# EAGLE schematic power electronicsV4.3 (EAGLE 9.6.2)

## Sheet 1 of 3
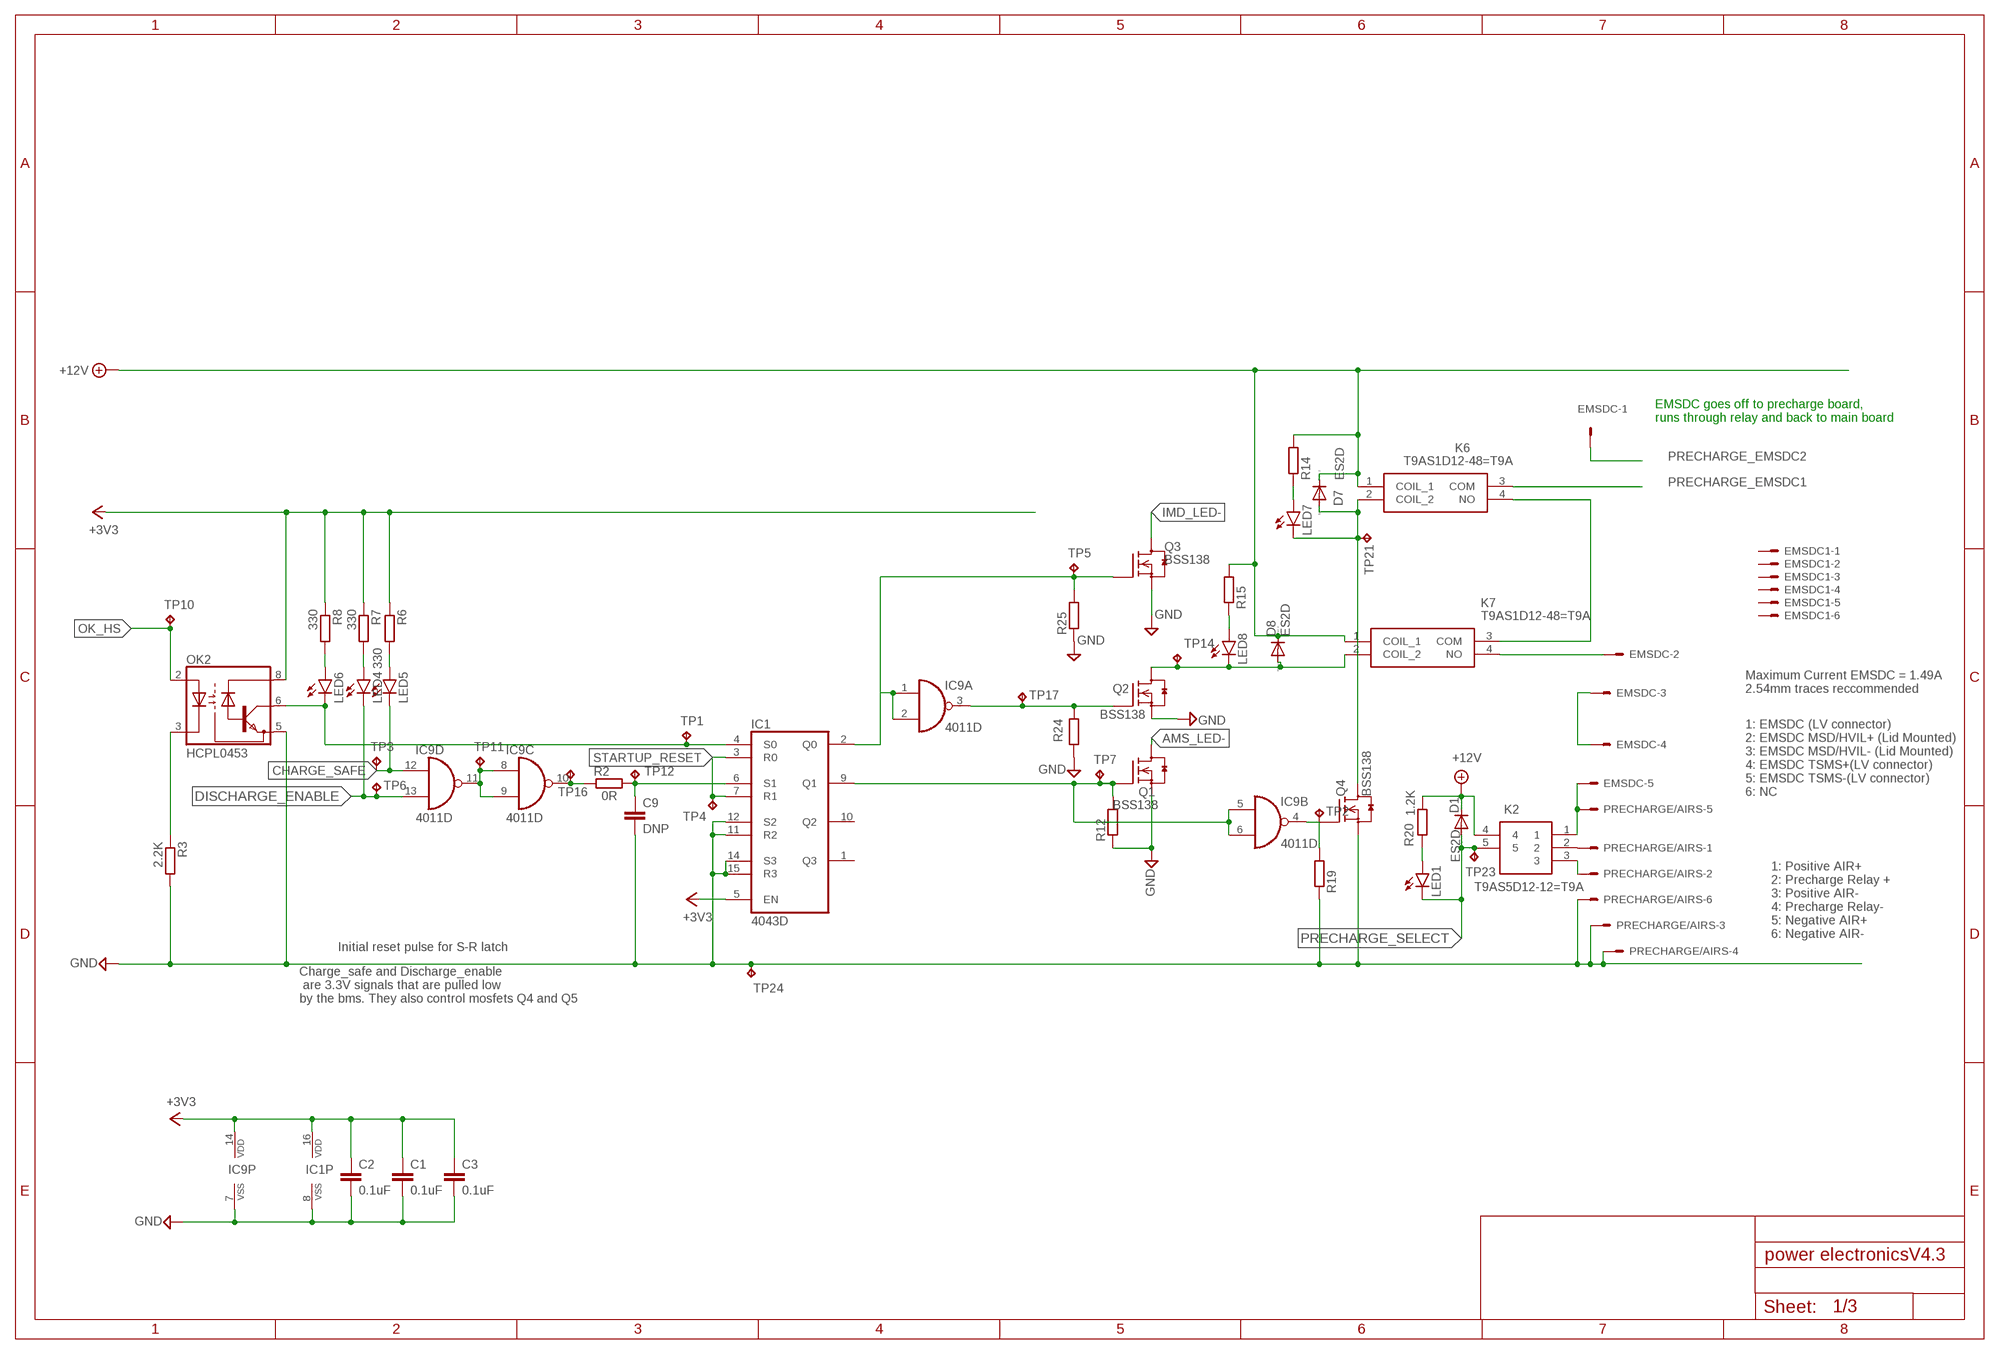
[diagram p0: schematic, sheet 1]

### Parts
C1  0.1uF  C-EUC0805  [C0805]
C2  0.1uF  C-EUC0805  [C0805]
C3  0.1uF  C-EUC0805  [C0805]
C9  DNP  C-EUC0805K  [C0805K]
D1  ES2D  [SMB]
D7  ES2D  [SMB]
D8  ES2D  [SMB]
EMSDC  KK-156-6  [KK-156-6]
EMSDC1  KK-156-6  [KK-156-6]
IC1  4043D  [SO16]
IC9  4011D  [SO14]
K2  T9AS5D12-12=T9A  [T9AS1D12]
K6  T9AS1D12-48=T9A  [T9AS1D1248T9A]
K7  T9AS1D12-48=T9A  [T9AS1D1248T9A]
LED1  LEDSML0805  [SML0805]
LED4  LEDSML0805  [SML0805]
LED5  LEDSML0805  [SML0805]
LED6  LEDSML0805  [SML0805]
LED7  LEDSML0805  [SML0805]
LED8  LEDSML0805  [SML0805]
OK2  HCPL0453  [SOIC08]
PRECHARGE/AIRS  KK-156-6  [KK-156-6]
Q1  BSS138  [SOT23]
Q2  BSS138  [SOT23]
Q3  BSS138  [SOT23]
Q4  BSS138  [SOT23]
R2  0R  R-EU_R0805  [R0805]
R3  2.2K  R-EU_R0805  [R0805]
R6  330  R-EU_R0805  [R0805]
R7  330  R-EU_R0805  [R0805]
R8  330  R-EU_R0805  [R0805]
R12  R-EU_R0805  [R0805]
R14  R-EU_R0805  [R0805]
R15  R-EU_R0805  [R0805]
R19  R-EU_R0805  [R0805]
R20  1.2K  R-EU_R0805  [R0805]
R24  R-EU_R0805  [R0805]
R25  R-EU_R0805  [R0805]
TP1  TPPAD1-17  [P1-17]
TP2  TPPAD1-17  [P1-17]
TP3  TPPAD1-17  [P1-17]
TP4  TPPAD1-17  [P1-17]
TP5  TPPAD1-17  [P1-17]
TP6  TPPAD1-17  [P1-17]
TP7  TPPAD1-17  [P1-17]
TP10  TPPAD1-17  [P1-17]
TP11  TPPAD1-17  [P1-17]
TP12  TPPAD1-17  [P1-17]
TP14  TPPAD1-17  [P1-17]
TP16  TPPAD1-17  [P1-17]
TP17  TPPAD1-17  [P1-17]
TP21  TPPAD1-17  [P1-17]
TP23  TPPAD1-17  [P1-17]
TP24  TPPAD1-17  [P1-17]

### Nets
+3V3: C1.1 C2.1 C3.1 IC1.5(EN) IC1.16(VDD) IC9.14(P:VDD) OK2.8(VCC) R6.1 R7.1 R8.1 ; also sheet 2,3
+12V [power]: D1.C D7.C D8.C K2.4 K6.1(COIL_1) K7.1(COIL_1) R14.2 R15.2 R20.1 ; also sheet 2,3
AMS_LED-: Q1.3(D)
CHARGE_SAFE: IC9.12(D:I0) LED5.C TP3.TP ; also sheet 3
DISCHARGE_ENABLE: IC1.9(Q1) IC9.5(B:I0) IC9.6(B:I1) IC9.13(D:I1) LED4.C Q1.1(G) R12.2 TP6.TP TP7.TP ; also sheet 3
GND [GND]: C1.2 C2.2 C3.2 C9.2 IC1.8(VSS) IC1.11(R2) IC1.12(S2) IC1.14(S3) IC1.15(R3) IC9.7(P:VSS) OK2.5(GND) PRECHARGE/AIRS.3 PRECHARGE/AIRS.4 PRECHARGE/AIRS.6 Q1.2(S) Q2.2(S) Q3.2(S) Q4.2(S) R3.2 R12.1 R19.1 R24.1 R25.1 TP24.TP ; also sheet 2,3
IMD_COIL_OUT: D8.A K7.2(COIL_2) LED8.C Q2.3(D) TP14.TP
IMD_LED-: Q3.3(D)
N$1: IC9.10(C:O) R2.1 TP16.TP
N$3 [EMSDC]: K2.2 PRECHARGE/AIRS.1
N$5: IC1.4(S0) LED6.C OK2.6(VO) TP1.TP
N$6: IC9.8(C:I0) IC9.9(C:I1) IC9.11(D:O) TP11.TP
N$7: OK2.3(C) R3.1
N$8: IC9.3(A:O) Q2.1(G) R24.2 TP17.TP
N$9: IC1.2(Q0) IC9.1(A:I0) IC9.2(A:I1) Q3.1(G) R25.2 TP5.TP
N$10: C9.1 IC1.6(S1) R2.2 TP12.TP
N$11 [EMSDC]: EMSDC.5 K2.1 PRECHARGE/AIRS.5
N$12 [EMSDC]: K2.3 PRECHARGE/AIRS.2
N$14: EMSDC.2 K7.4(NO)
N$15 [GND]: D7.A K6.2(COIL_2) LED7.C Q4.3(D) TP21.TP
N$16: IC9.4(B:O) Q4.1(G) R19.2 TP2.TP
N$18: LED7.A R14.1
N$19 [EMSDC]: EMSDC.3 EMSDC.4
N$20: LED8.A R15.1
N$21 [GND]: K6.4(NO) K7.3(COM)
N$22: LED1.A R20.2
N$25: LED4.A R7.2
N$26: LED5.A R6.2
N$27: LED6.A R8.2
OK_HS: OK2.2(A) TP10.TP ; also sheet 3
PRECHARGE_EMSDC1: K6.3(COM) ; also sheet 3
PRECHARGE_EMSDC2: EMSDC.1 ; also sheet 3
PRECHARGE_SELECT: D1.A K2.5 LED1.C TP23.TP ; also sheet 3
STARTUP_RESET: IC1.3(R0) IC1.7(R1) TP4.TP ; also sheet 2
Unconnected: EMSDC1.1 EMSDC1.2 EMSDC1.3 EMSDC1.4 EMSDC1.5 EMSDC1.6 EMSDC.6 IC1.1(Q3) IC1.10(Q2)

### Notes on the sheet
- EMSDC goes off to precharge board, 
  runs through relay and back to main board
- Maximum Current EMSDC = 1.49A
  2.54mm traces reccommended
- 1: EMSDC (LV connector)
  2: EMSDC MSD/HVIL+ (Lid Mounted)
  3: EMSDC MSD/HVIL- (Lid Mounted)
  4: EMSDC TSMS+(LV connector)
  5: EMSDC TSMS-(LV connector)
  6: NC
- 1: Positive AIR+
  2: Precharge Relay +
  3: Positive AIR-
  4: Precharge Relay-
  5: Negative AIR+
  6: Negative AIR-
- Initial reset pulse for S-R latch
- Charge_safe and Discharge_enable
   are 3.3V signals that are pulled low 
  by the bms. They also control mosfets Q4 and Q5

## Sheet 2 of 3
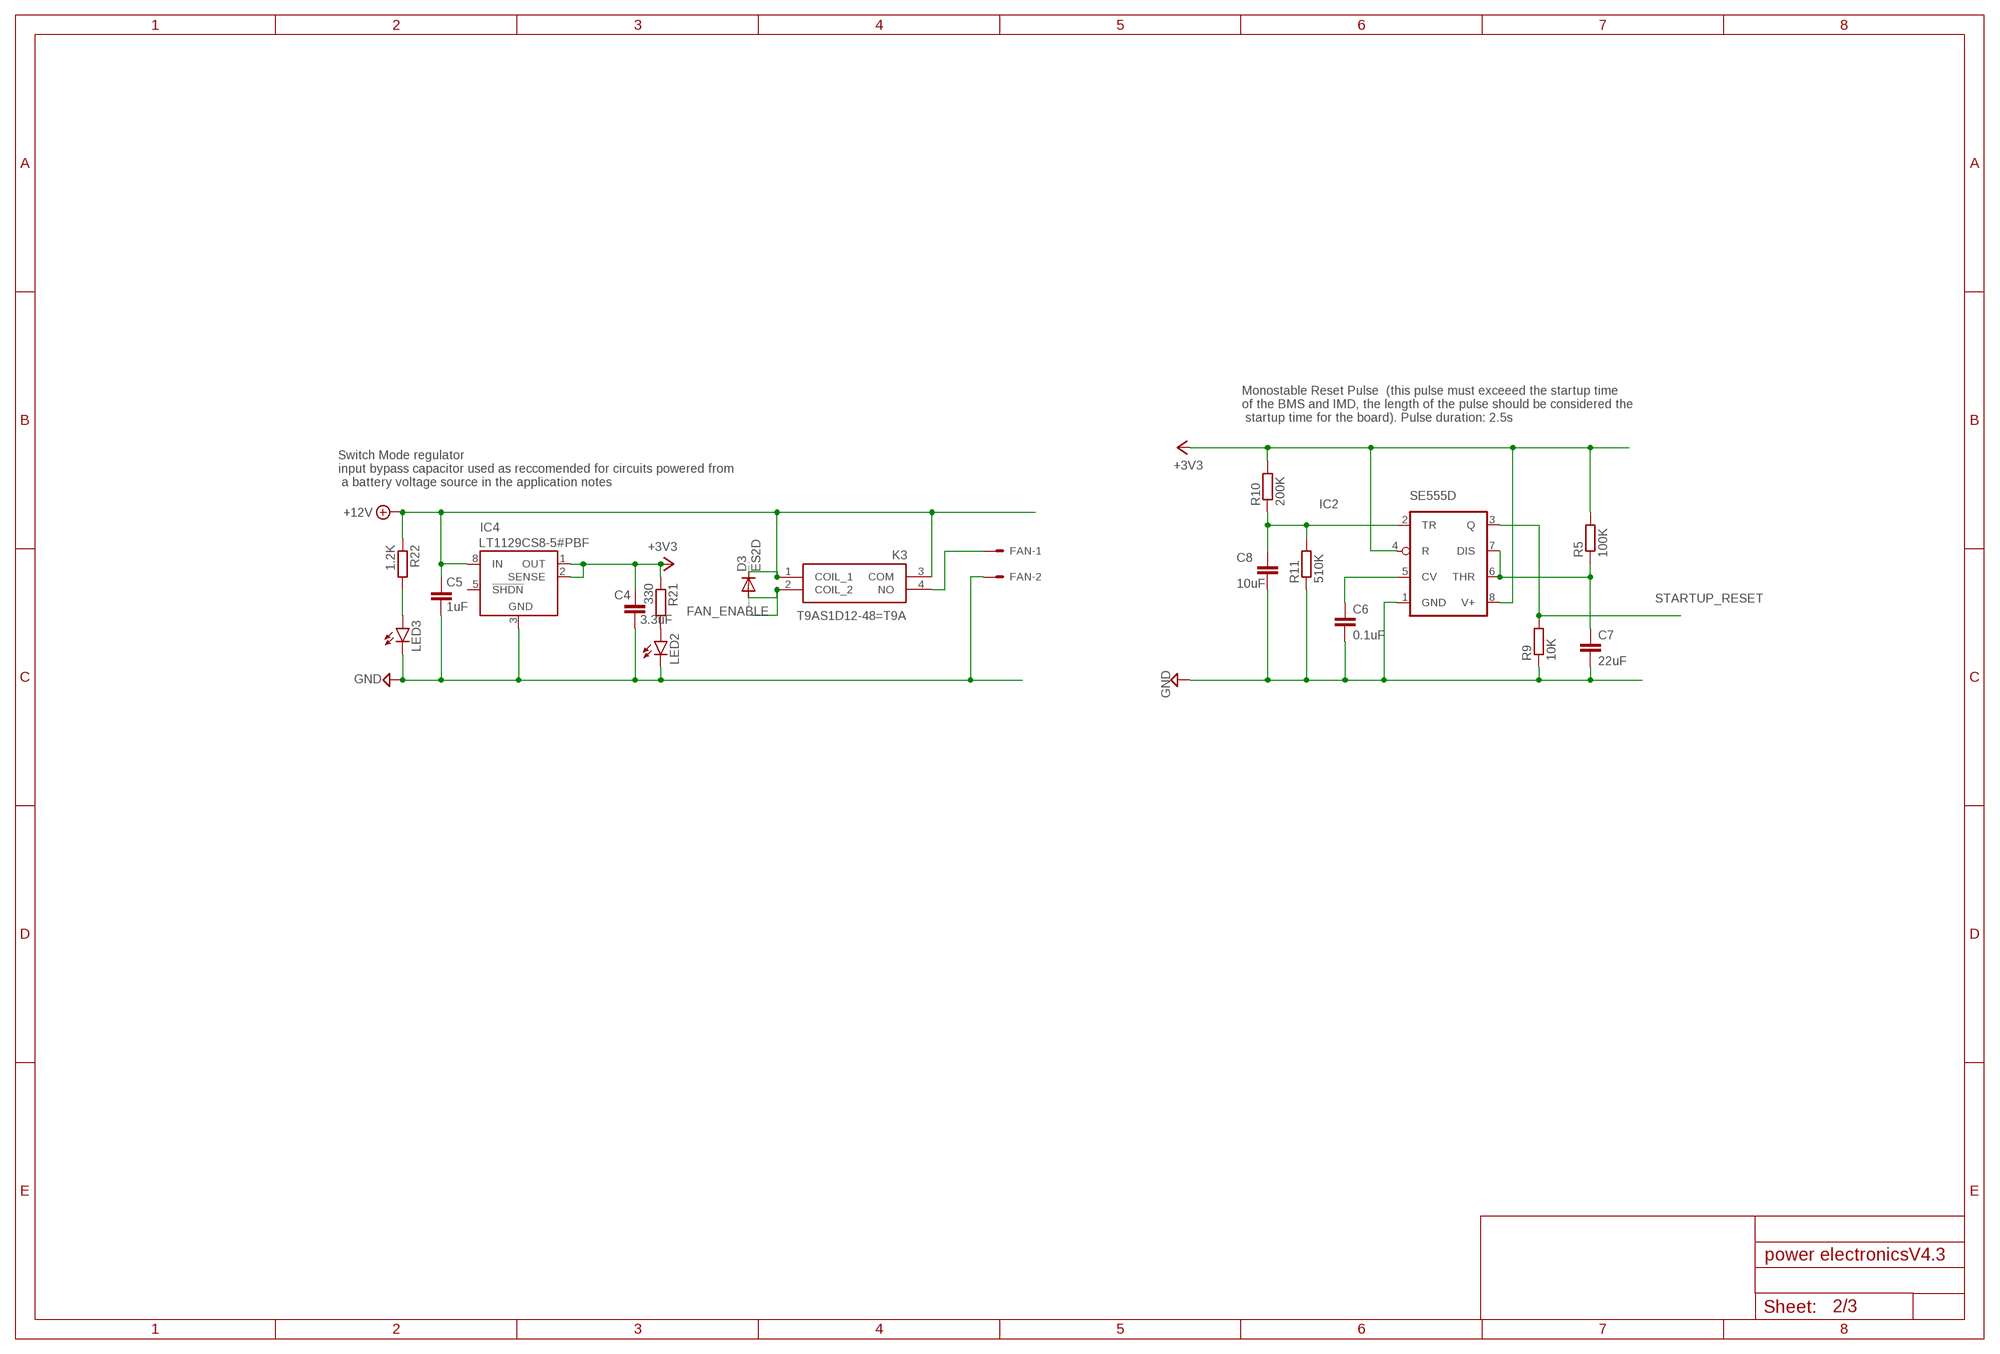
[diagram p1: schematic, sheet 2]

### Parts
C4  3.3uF  C-EUC0805  [C0805]
C5  1uF  C-EUC0805  [C0805]
C6  0.1uF  C-EUC0805  [C0805]
C7  22uF  C-EUC1206  [C1206]
C8  10uF  C-EUC0805  [C0805]
D3  ES2D  [SMB]
FAN  KK-156-2  [KK-156-2]
IC2  SE555D  [SO08]
IC4  LT1129CS8  [SOIC8]
K3  T9AS1D12-48=T9A  [T9AS1D1248T9A]
LED2  LEDSML0805  [SML0805]
LED3  LEDSML0805  [SML0805]
R5  100K  R-EU_R0805  [R0805]
R9  10K  R-EU_R0805  [R0805]
R10  200K  R-EU_R0805  [R0805]
R11  510K  R-EU_R0805  [R0805]
R21  330  R-EU_R0805  [R0805]
R22  1.2K  R-EU_R0805  [R0805]

### Nets
+3V3: C4.1 IC2.4(R) IC2.8(V+) IC4.1(OUT) IC4.2(SENSE) R5.2 R10.2 R21.1 ; also sheet 1,3
+12V [power]: C5.1 D3.C IC4.8(IN) K3.1(COIL_1) K3.3(COM) R22.1 ; also sheet 1,3
FAN+ [power]: FAN.1 K3.4(NO)
FAN_ENABLE: D3.A K3.2(COIL_2) ; also sheet 3
GND [GND]: C4.2 C5.2 C6.2 C7.2 C8.2 FAN.2 IC2.1(GND) IC4.3(GND) LED2.C LED3.C R9.1 R11.1 ; also sheet 1,3
N$17: C7.1 IC2.6(THR) IC2.7(DIS) R5.1
N$23: LED2.A R21.2
N$24: LED3.A R22.2
N$28: C8.1 IC2.2(TR) R10.1 R11.2
N$32: C6.1 IC2.5(CV)
STARTUP_RESET: IC2.3(Q) R9.2 ; also sheet 1
Unconnected: IC4.4(NC) IC4.5(!SHDN)

### Notes on the sheet
- Monostable Reset Pulse  (this pulse must exceeed the startup time 
  of the BMS and IMD, the length of the pulse should be considered the
   startup time for the board). Pulse duration: 2.5s
- Switch Mode regulator
  input bypass capacitor used as reccomended for circuits powered from
   a battery voltage source in the application notes

## Sheet 3 of 3
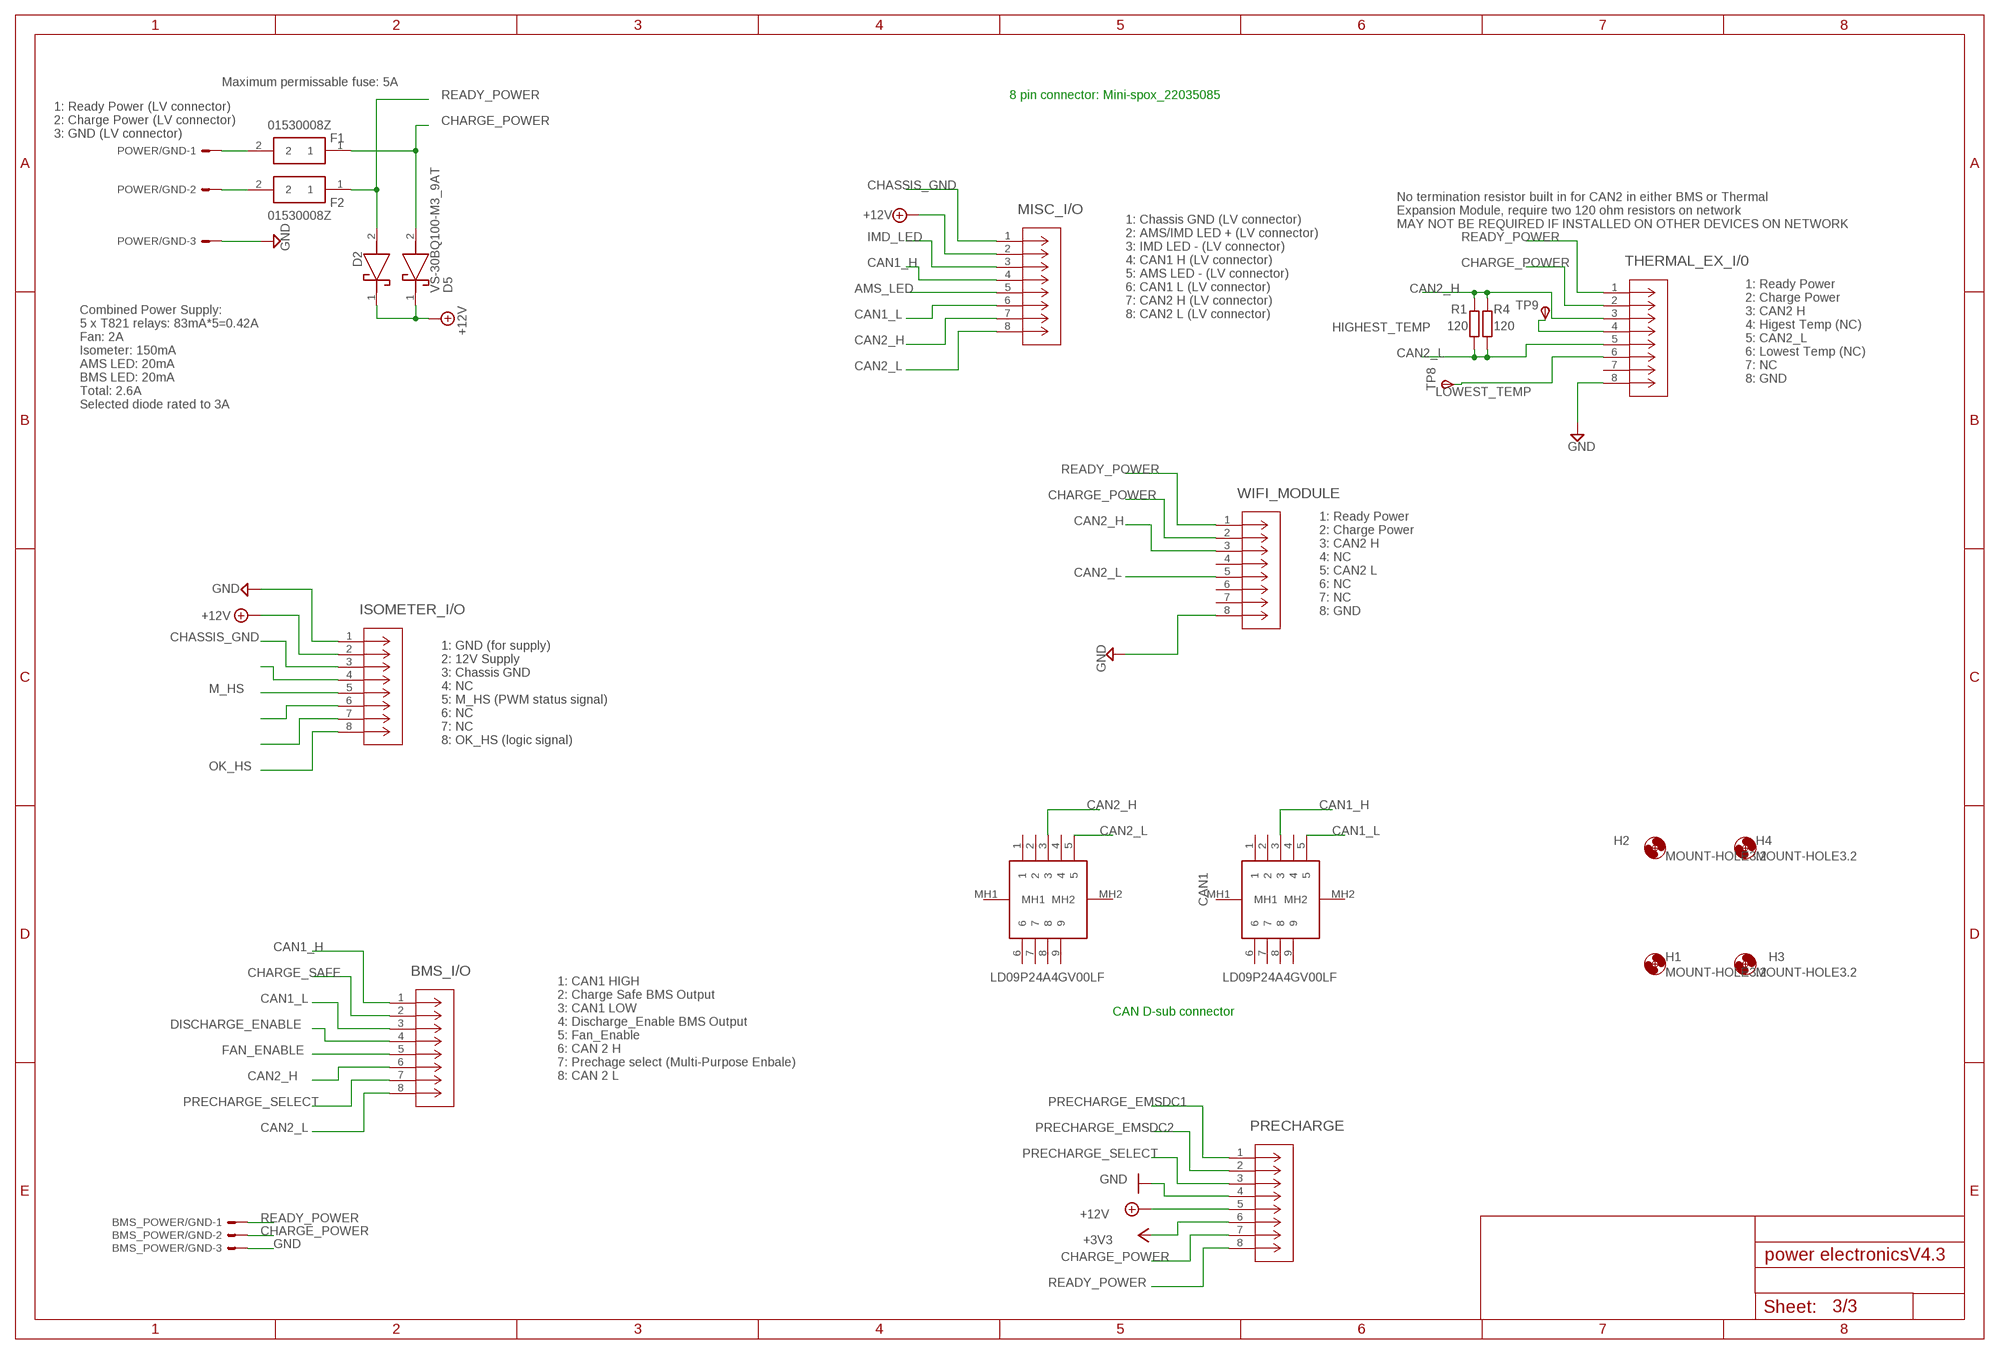
[diagram p2: schematic, sheet 3]

### Parts
BMS_I/O  MINI-SPOX_22035085  [CON_22035085_MOL]
BMS_POWER/GND  KK-156-3  [KK-156-3]
CAN1  LD09P24A4GV00LF  [LD09P24A4GV00LF]
CAN2  LD09P24A4GV00LF  [LD09P24A4GV00LF]
D2  VS-30BQ100-M3_9AT  [DIOM7959X262N]
D5  VS-30BQ100-M3_9AT  [DIOM7959X262N]
F1  01530008Z  [01530008]
F2  01530008Z  [01530008]
H1  MOUNT-HOLE3.2  [3,2]
H2  MOUNT-HOLE3.2  [3,2]
H3  MOUNT-HOLE3.2  [3,2]
H4  MOUNT-HOLE3.2  [3,2]
ISOMETER_I/O  MINI-SPOX_22035085  [CON_22035085_MOL]
MISC_I/O  MINI-SPOX_22035085  [CON_22035085_MOL]
POWER/GND  KK-156-3  [KK-156-3]
PRECHARGE  MINI-SPOX_22035085  [CON_22035085_MOL]
R1  120  R-EU_R1206  [R1206]
R4  120  R-EU_R1206  [R1206]
THERMAL_EX_I/0  MINI-SPOX_22035085  [CON_22035085_MOL]
TP8  TPSTP11R  [TP11R]
TP9  TPSTP11R  [TP11R]
WIFI_MODULE  MINI-SPOX_22035085  [CON_22035085_MOL]

### Nets
+3V3: PRECHARGE.6 ; also sheet 1,2
+12V [power]: D2.1(K) D5.1(K) ISOMETER_I/O.2 MISC_I/O.2 PRECHARGE.5 ; also sheet 1,2
AMS_LED: MISC_I/O.5
CAN1_H: BMS_I/O.1 CAN1.3 MISC_I/O.4
CAN1_L: BMS_I/O.3 CAN1.5 MISC_I/O.6
CAN2_H: BMS_I/O.6 CAN2.3 MISC_I/O.7 R1.1 R4.1 THERMAL_EX_I/0.3 WIFI_MODULE.3
CAN2_L: BMS_I/O.8 CAN2.5 MISC_I/O.8 R1.2 R4.2 THERMAL_EX_I/0.5 WIFI_MODULE.5
CHARGE_POWER [power]: BMS_POWER/GND.2 D5.2(A) F1.1 PRECHARGE.7 THERMAL_EX_I/0.2 WIFI_MODULE.2
CHARGE_SAFE: BMS_I/O.2 ; also sheet 1
CHASSIS_GND [GND]: ISOMETER_I/O.3 MISC_I/O.1
DISCHARGE_ENABLE: BMS_I/O.4 ; also sheet 1
FAN_ENABLE: BMS_I/O.5 ; also sheet 2
GND [GND]: BMS_POWER/GND.3 ISOMETER_I/O.1 POWER/GND.3 PRECHARGE.4 THERMAL_EX_I/0.8 WIFI_MODULE.8 ; also sheet 1,2
HIGHEST_TEMP: THERMAL_EX_I/0.4 TP9.TP(PP)
IMD_LED: MISC_I/O.3
LOWEST_TEMP: THERMAL_EX_I/0.6 TP8.TP(PP)
M_HS: ISOMETER_I/O.5
N$2 [power]: F2.2 POWER/GND.2
N$4 [power]: F1.2 POWER/GND.1
N$46: ISOMETER_I/O.4
N$51: ISOMETER_I/O.7
N$52: ISOMETER_I/O.6
OK_HS: ISOMETER_I/O.8 ; also sheet 1
PRECHARGE_EMSDC1: PRECHARGE.1 ; also sheet 1
PRECHARGE_EMSDC2: PRECHARGE.2 ; also sheet 1
PRECHARGE_SELECT: BMS_I/O.7 PRECHARGE.3 ; also sheet 1
READY_POWER [power]: BMS_POWER/GND.1 D2.2(A) F2.1 PRECHARGE.8 THERMAL_EX_I/0.1 WIFI_MODULE.1
Unconnected: CAN1.1 CAN1.2 CAN1.4 CAN1.6 CAN1.7 CAN1.8 CAN1.9 CAN1.MH1 CAN1.MH2 CAN2.1 CAN2.2 CAN2.4 CAN2.6 CAN2.7 CAN2.8 CAN2.9 CAN2.MH1 CAN2.MH2 THERMAL_EX_I/0.7 WIFI_MODULE.4 WIFI_MODULE.6 WIFI_MODULE.7

### Notes on the sheet
- Maximum permissable fuse: 5A
- 8 pin connector: Mini-spox_22035085
- 1: Ready Power (LV connector)
  2: Charge Power (LV connector)
  3: GND (LV connector)
- No termination resistor built in for CAN2 in either BMS or Thermal
  Expansion Module, require two 120 ohm resistors on network
  MAY NOT BE REQUIRED IF INSTALLED ON OTHER DEVICES ON NETWORK
- 1: Chassis GND (LV connector)
  2: AMS/IMD LED + (LV connector)
  3: IMD LED - (LV connector)
  4: CAN1 H (LV connector)
  5: AMS LED - (LV connector)
  6: CAN1 L (LV connector)
  7: CAN2 H (LV connector)
  8: CAN2 L (LV connector)
- 1: Ready Power
  2: Charge Power
  3: CAN2 H
  4: Higest Temp (NC)
  5: CAN2_L
  6: Lowest Temp (NC)
  7: NC
  8: GND
- Combined Power Supply:
  5 x T821 relays: 83mA*5=0.42A
  Fan: 2A
  Isometer: 150mA
  AMS LED: 20mA
  BMS LED: 20mA
  Total: 2.6A
  Selected diode rated to 3A
- 1: Ready Power
  2: Charge Power
  3: CAN2 H
  4: NC
  5: CAN2 L
  6: NC
  7: NC
  8: GND
- 1: GND (for supply) 
  2: 12V Supply
  3: Chassis GND 
  4: NC 
  5: M_HS (PWM status signal)
  6: NC
  7: NC
  8: OK_HS (logic signal)
- CAN D-sub connector
- 1: CAN1 HIGH
  2: Charge Safe BMS Output 
  3: CAN1 LOW
  4: Discharge_Enable BMS Output
  5: Fan_Enable
  6: CAN 2 H
  7: Prechage select (Multi-Purpose Enbale)
  8: CAN 2 L

## Power pins joined to a net without a drawn wire
GND: IC4.6(GND) IC4.7(GND)

## Library data of the parts
BMS_I/O ISOMETER_I/O MISC_I/O PRECHARGE THERMAL_EX_I/0 WIFI_MODULE = Mini-spox_22035085:MINI-SPOX_22035085; COPYRIGHT: Copyright (C) 2023 Ultra Librarian. All rights reserved.; MANUFACTURER_PART_NUMBER: 22035085; MFR_NAME: Molex Connector Corporation
BMS_POWER/GND POWER/GND = con-molex:KK-156-3: KK 156 HEADER Source: http://www.molex.com/pdm_docs/sd/026604100_sd.pdf; MF: MOLEX; OC_FARNELL: unknown; OC_NEWARK: unknown
C1-C9 = rcl:C-EU: CAPACITOR, European symbol; SPICEPREFIX: C
CAN1 CAN2 = LD09P24A4GV00LF:LD09P24A4GV00LF: Amphenol FCI LD Series, 9 Way Plug-In Mount D-sub Connector Plug, 2.74mm Pitch, with Screw Source: Datasheet <https://www.mouser.com/datasheet/2/18/10130912-1362365.pdf>; ARROW_PART_NUMBER: LD09P24A4GV00LF; ARROW_PRICE-STOCK: https://www.arrow.com/en/products/ld09p24a4gv00lf/amphenol-fci?region=nac; DESCRIPTION: Amphenol FCI LD Series, 9 Way Plug-In Mount D-sub Connector Plug, 2.74mm Pitch, with Screw; HEIGHT: 12.15mm; MANUFACTURER_NAME: Amphenol Communication Solutions; MANUFACTURER_PART_NUMBER: LD09P24A4GV00LF; MOUSER_PART_NUMBER: 649-LD09P24A4GV00LF; MOUSER_PRICE-STOCK: https://www.mouser.co.uk/ProductDetail/Amphenol-FCI/LD09P24A4GV00LF?qs=tZOhSuJQg1nfkziarphghA%3D%3D
D1 D3 D7 D8 = diode:ES2D: DIODE super fast rectifier, 2 A
D2 D5 = SamacSys_Parts:VS-30BQ100-M3_9AT: Vishay VS-30BQ100-M3/9AT SMT Schottky Diode, 100V 3A, 2-Pin DO-214AB Source: Datasheet <https://componentsearchengine.com/Datasheets/1/VS-30BQ100-M3_9AT.pdf>; DESCRIPTION: Vishay VS-30BQ100-M3/9AT SMT Schottky Diode, 100V 3A, 2-Pin DO-214AB; HEIGHT: 2.62mm; MANUFACTURER_NAME: Vishay; MANUFACTURER_PART_NUMBER: VS-30BQ100-M3/9AT; MOUSER_PART_NUMBER: 78-VS-30BQ100-M39AT; MOUSER_PRICE-STOCK: https://www.mouser.com/Search/Refine.aspx?Keyword=78-VS-30BQ100-M39AT
EMSDC EMSDC1 PRECHARGE/AIRS = con-molex:KK-156-6: KK 156 HEADER Source: http://www.molex.com/pdm_docs/sd/026604100_sd.pdf; MF: MOLEX; OC_FARNELL: unknown; OC_NEWARK: unknown
F1 F2 = SamacSys_Parts:01530008Z: Mini fuseholder,15A 32V Littelfuse 15A PCB Mount Fuse Holder Automotive Fuse, 32 V Source: Datasheet <http://www.littelfuse.com/data/en/data_sheets/153_pcmount.pdf>; ALLIED_NUMBER: 70184304; DESCRIPTION: Mini fuseholder,15A 32V Littelfuse 15A PCB Mount Fuse Holder Automotive Fuse, 32 V; HEIGHT: mm; MANUFACTURER_NAME: LITTELFUSE; MANUFACTURER_PART_NUMBER: 01530008Z; RS_PART_NUMBER: 3607317; RS_PRICE-STOCK: https://uk.rs-online.com/web/p/products/3607317
FAN = con-molex:KK-156-2: KK 156 HEADER Source: http://www.molex.com/pdm_docs/sd/026604100_sd.pdf; MF: MOLEX; OC_FARNELL: unknown; OC_NEWARK: unknown
H1-H4 = holes:MOUNT-HOLE: MOUNTING HOLE with drill center marker
IC1 = 40xx:4043: Quad 3-state NOR R/S LATCH
IC2 = linear:*555: TIMER
IC4 = linear-technology:LT1129CS8: VOLTAGE REGULATOR with shutdown; MPN: LT1129CS8-5#PBF; OC_FARNELL: 1273576; OC_NEWARK: 57M2078
IC9 = 40xx:4011: Quad 2-input NAND
K2 = SamacSys_Parts:T9AS5D12-12=T9A: PCB Relay SPDT 30A 12Vdc,thru hole SPDT PCB Mount Non-Latching Relay Through Hole, 12V dc Source: Datasheet; ALLIED_NUMBER: R1111589; DESCRIPTION: PCB Relay SPDT 30A 12Vdc,thru hole SPDT PCB Mount Non-Latching Relay Through Hole, 12V dc; HEIGHT: mm; MANUFACTURER_NAME: TE Connectivity; MANUFACTURER_PART_NUMBER: T9AS5D12-12=T9A; RS_PART_NUMBER: 6802528; RS_PRICE-STOCK: https://uk.rs-online.com/web/p/products/6802528
K3 = SamacSys_Parts:T9AS1D12-48=T9A: SPST-NO PCB Mount Non-Latching Relay Through Hole, 48V dc Source: Datasheet; DESCRIPTION: SPST-NO PCB Mount Non-Latching Relay Through Hole, 48V dc; HEIGHT: 20.4mm; MANUFACTURER_NAME: TE Connectivity; MANUFACTURER_PART_NUMBER: T9AS1D12-48=T9A; RS_PART_NUMBER: 6802534P; RS_PRICE-STOCK: http://uk.rs-online.com/web/p/products/6802534P
K6 K7 = T9AS1D12-12=T9A:T9AS1D12-48=T9A: SPST-NO PCB Mount Non-Latching Relay Through Hole, 48V dc Source: Datasheet; DESCRIPTION: SPST-NO PCB Mount Non-Latching Relay Through Hole, 48V dc; HEIGHT: 20.4mm; MANUFACTURER_NAME: TE Connectivity; MANUFACTURER_PART_NUMBER: T9AS1D12-48=T9A
LED1-LED8 = led:LED: LED OSRAM: - CHIPLED LG R971, LG N971, LY N971, LG Q971, LY Q971, LO R971, LY R971 LH N974, LH R974 LS Q976, LO Q976, LY Q976 LO Q996 - Hyper CHIPLED LW Q18S LB Q993, LB Q99A, LB R99A - SideLED LS A670, LO A670, LY A670, LG A670, LP A670 LB A673, LV A673, LT A673, LW A673 LH A674 LY A675 LS A676, LA A676, LO A676, LY A676, LW A676 LS A679, LY A679, LG A679 - Hyper Micro SIDELED® LS Y876, LA Y876, LO Y876, LY Y876 LT Y87S - SmartLED LW L88C, LW L88S LB L89C, LB L89S, LG L890 LS L89K, LO L89K, LY L89K LS L896, LA L896, LO L896, LY L896 - TOPLED LS T670, LO T670, LY T670, LG T670, LP T670 LSG T670, LSP T670, LSY T670, LOP T670, LYG T670 LG T671, LOG T671, LSG T671 LB T673, LV T673, LT T673, LW T673 LH T674 LS T676, LA T676, LO T676, LY T676, LB T676, LH T676, LSB T676, LW T676 LB T67C, LV T67C, LT T67C, LS T67K, LO T67K, LY T67K, LW E67C LS E67B, LA E67B, LO E67B, LY E67B, LB E67C, LV E67C, LT E67C LW T67C LS T679, LY T679, LG T679 LS T770, LO T770, LY T770, LG T770, LP T770 LB T773, LV T773, LT T773, LW T773 LH T774 LS E675, LA E675, LY E675, LS T675 LS T776, LA T776, LO T776, LY T776, LB T776 LHGB T686 LT T68C, LB T68C - Hyper Mini TOPLED® LB M676 - Mini TOPLED Santana® LG M470 LS M47K, LO M47K, LY M47K Source: http://www.osram.convergy.de LUXEON: - LUMILED® LXK2-PW12-R00, LXK2-PW12-S00, LXK2-PW14-U00, LXK2-PW14-V00 LXK2-PM12-R00, LXK2-PM12-S00, LXK2-PM14-U00 LXK2-PE12-Q00, LXK2-PE12-R00, LXK2-PE12-S00, LXK2-PE14-T00, LXK2-PE14-U00 LXK2-PB12-K00, LXK2-PB12-L00, LXK2-PB12-M00, LXK2-PB14-N00, LXK2-PB14-P00, LXK2-PB14-Q00 LXK2-PR12-L00, LXK2-PR12-M00, LXK2-PR14-Q00, LXK2-PR14-R00 LXK2-PD12-Q00, LXK2-PD12-R00, LXK2-PD12-S00 LXK2-PH12-R00, LXK2-PH12-S00 LXK2-PL12-P00, LXK2-PL12-Q00, LXK2-PL12-R00 Source: www.luxeon.com KINGBRIGHT: KA-3528ASYC Source: www.kingbright.com
OK2 = optocoupler:HCPL0453: HEWLETT PACKARD OPTO COUPLER; MF: AGILENT TECHNOLOGIES; MPN: HCPL-0453-000E; OC_FARNELL: 1505123; OC_NEWARK: 88H7766
Q1-Q4 = m-pad-2.1:BSS138: Fairchild Semiconductors BSS138 N-Channel Logic Level Enhancement Mode Field Effect Transistor General Description: These N-Channel enhancement mode field effect transistors are produced using Fairchild's proprietary, high cell density, DMOS technology. These products have been designed to minimize on-state resistance while provide rugged, reliable, and fast switching performance.These products are particularly suited for low voltage, low current applications such as small servo motor control, power MOSFET gate drivers, and other switching applications. Features: 0.22 A, 50 V. RDS(ON) = 3.5Ohm @ VGS = 10 V RDS(ON) = 6.0Ohm @ VGS = 4.5 V High density cell design for extremely low RDS(ON) Rugged and Reliable Compact industry standard SOT-23 surface mount package Please send any comments to: messi@users.sourceforge.net
R1-R12 R14 R15 R19-R22 R24 R25 = rcl:R-EU_: RESISTOR, European symbol; SPICEPREFIX: R
TP1-TP7 TP10-TP12 TP14 TP16 TP17 TP21 TP23 TP24 = testpad:TP: Test pad
TP8 TP9 = testpad:TPS: TEST PIN

## Net classes
0 default: width 0.508 mm
1 GND: width 0.889 mm
2 EMSDC: width 2.54 mm
3 power: width 0.889 mm